# EasyEDA schematic 1-Schematic_Rotopano.json
REV: 2.0; Date: 2018-05-24; Sheet: 1/1; Drawn By: ydethe
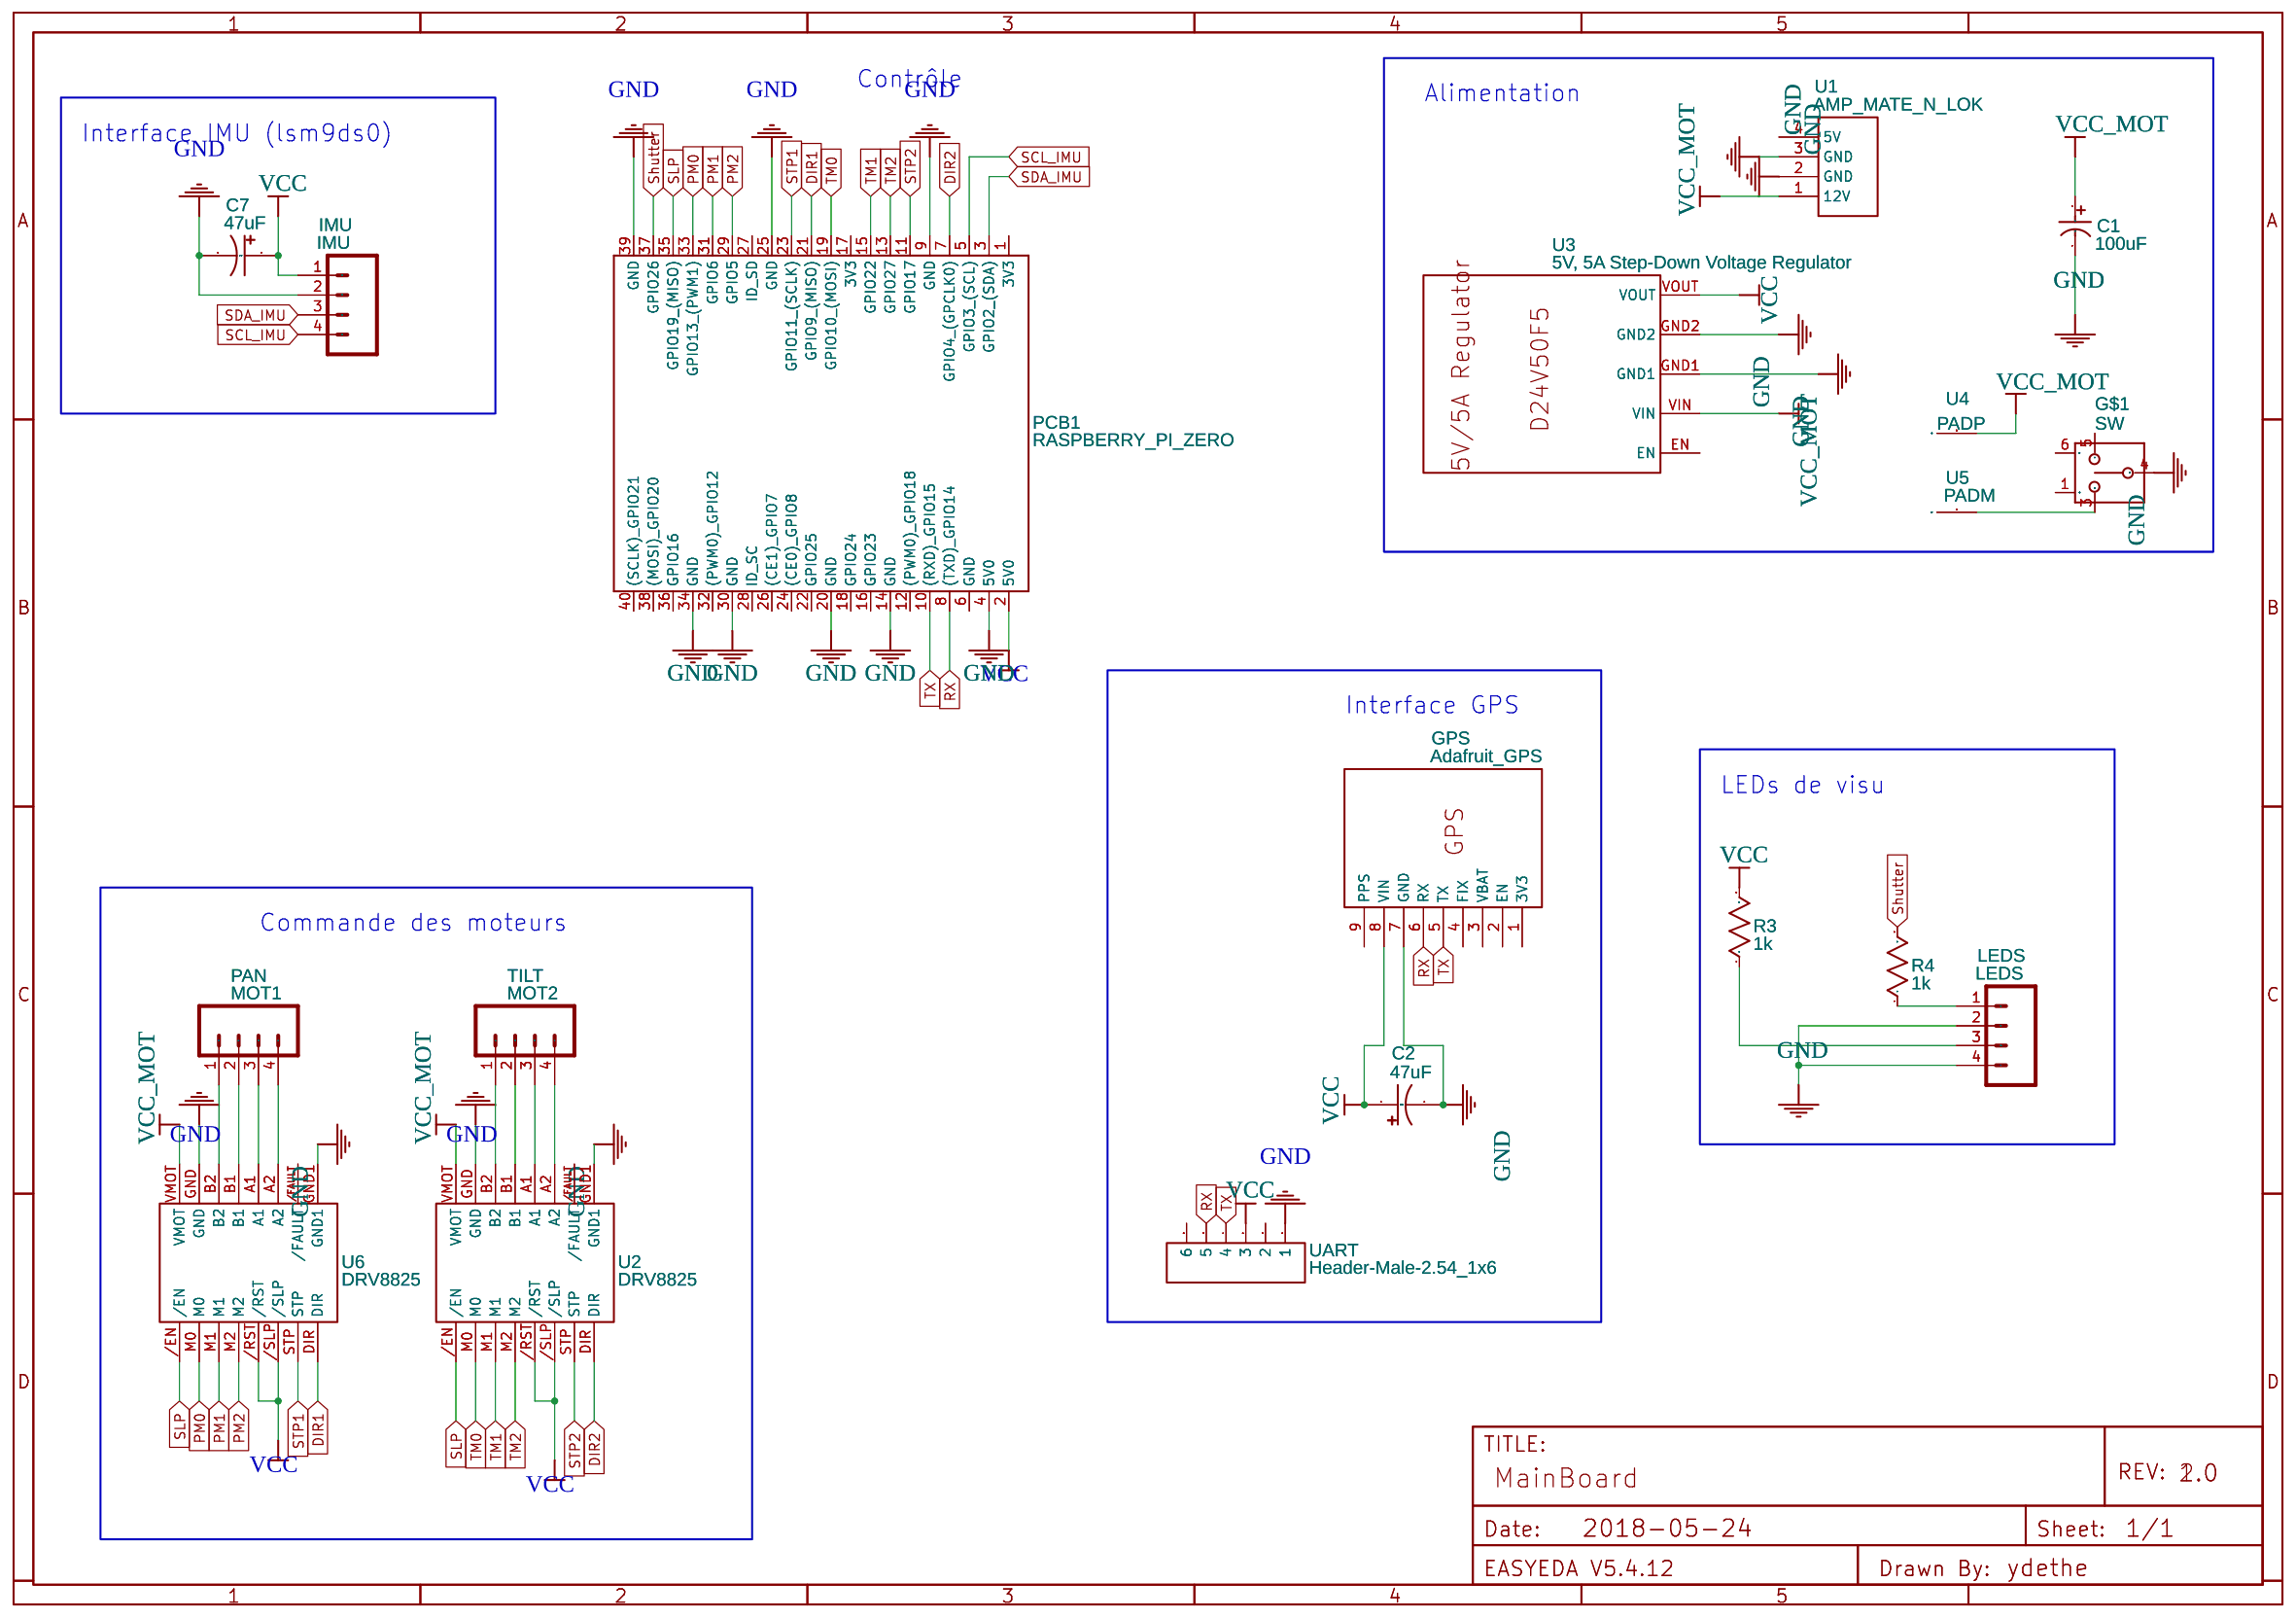
[diagram p0: schematic sheet]

## Parts
C1  100uF  [CAP-8*5]
C2  47uF  [CAP-D6.3XF2.5]
C7  47uF  [CAP-D6.3XF2.5]
G$1  SW  [RSPRO-_734-7315]
GPS  Adafruit_GPS  [ADAFRUIT_GPS]
IMU  IMU  [MOLEX-1X4]
LEDS  LEDS  [MOLEX-1X4]
PAN  MOT1  [MOLEX-1X4]
PCB1  RASPBERRY_PI_ZERO  [RASPBERRY PI (FACE UP)]
R3  1k  [AXIAL-0.3]
R4  1k  [AXIAL-0.3]
TILT  MOT2  [MOLEX-1X4]
U1  AMP_MATE_N_LOK  [AMP_MATE_N_LOK]
U2  DRV8825  [DRV8825]
U3  5V, 5A Step-Down Voltage Regulator  [D24V50F5]
U4  PADP  [PAD-100X55-RRECT]
U5  PADM  [PAD-100X55-RRECT]
U6  DRV8825  [DRV8825]
UART  Header-Male-2.54_1x6  [HDR-6X1/2.54]

## Library data of the parts
C1 = 100uF 25V: Supplier: LCSC; Manufacturer: ReliaPro; Supplier Part: C13376
C2 C7 = Cap_Electrolytic(TH)_D6.3XF2.5_US: Manufacturer Part: ?
G$1 = -: Contributor: liose; Manufacturer Part: ?
GPS = -: Manufacturer Part: Adafruit Ultimate GPS Breakout - 66 channel w/10 Hz updates - Version 3; Supplier Part: undefined; Supplier: Adafruit; link: https://learn.adafruit.com/adafruit-ultimate-gps/overview; Contributor: ydethe
IMU LEDS PAN TILT = -: Header 4; Contributor: SparkFun; Manufacturer Part: ?
PCB1 = -: Raspberry Pi Zero; sourceId: a8qICUO6o; Manufacturer Part: ?
R3 R4 = Res_AXIAL-0.3(1/8W)_US: Manufacturer Part: ?
U1 = -: Manufacturer Part: 350424-1; Supplier Part: 718-9605; Supplier: RS-Online; link: https://fr.rs-online.com/web/p/embases-de-circuit-imprime/7189605/; Contributor: ydethe
U2 U6 = -: Manufacturer Part: Pololu; Contributor: ydethe; Supplier: Pololu; link: https://www.pololu.com/product/2133; Supplier Part: undefined
U3 = -: Contributor: ydethe; Supplier: Pololu; link: https://www.pololu.com/product/2851/pictures
U4 U5 = -: Contributor: Pinoccio; Manufacturer Part: ?
UART = -: Supplier Part: C37208; Supplier: LCSC; Manufacturer: BOOMELE

## Nets
GND: C1.2 C2.2 C7.2 G$1.4(2) GPS.7(GND) IMU.2 LEDS.2 LEDS.4 PCB1.4(5V0) PCB1.9(GND) PCB1.14(GND) PCB1.20(GND) PCB1.25(GND) PCB1.30(GND) PCB1.34(GND) PCB1.39(GND) U1.2(GND) U1.3(GND) U2.GND U2.GND1 U3.GND1 U3.GND2 U6.GND U6.GND1 UART.1
VCC: C2.1 C7.1 GPS.8(VIN) IMU.1 PCB1.2(5V0) R3.2 U2./RST U2./SLP U3.VOUT U6./RST U6./SLP UART.3
VCC_MOT: C1.1 U1.1(12V) U2.VMOT U3.VIN U4.P$1 U6.VMOT
DIR1: PCB1.21(GPIO9 (MISO)) U6.DIR
DIR2: PCB1.7(GPIO4 (GPCLK0)) U2.DIR
PM0: PCB1.33(GPIO13 (PWM1)) U6.M0
PM1: PCB1.31(GPIO6) U6.M1
PM2: PCB1.29(GPIO5) U6.M2
RX: GPS.6(RX) PCB1.8((TXD) GPIO14) UART.5
SCL_IMU: IMU.4 PCB1.5(GPIO3 (SCL))
SDA_IMU: IMU.3 PCB1.3(GPIO2 (SDA))
Shutter: PCB1.37(GPIO26) R4.2
SLP: PCB1.35(GPIO19 (MISO)) U2./EN U6./EN
STP1: PCB1.23(GPIO11 (SCLK)) U6.STP
STP2: PCB1.11(GPIO17) U2.STP
TM0: PCB1.19(GPIO10 (MOSI)) U2.M0
TM1: PCB1.15(GPIO22) U2.M1
TM2: PCB1.13(GPIO27) U2.M2
TX: GPS.5(TX) PCB1.10((RXD) GPIO15) UART.4
PAN_1: PAN.1 U6.B2
PAN_2: PAN.2 U6.B1
PAN_3: PAN.3 U6.A1
PAN_4: PAN.4 U6.A2
R3_1: LEDS.3 R3.1
R4_1: LEDS.1 R4.1
TILT_1: TILT.1 U2.B2
TILT_2: TILT.2 U2.B1
TILT_3: TILT.3 U2.A1
TILT_4: TILT.4 U2.A2
U5_P$1: G$1.3 U5.P$1

Not connected (* = marked no-connect by the designer): G$1 1(G2) 5(1) 6(G1); GPS 1(3V3) 2(EN) 3(VBAT) 4(FIX) 9(PPS); PCB1 1(3V3) 6(GND) 12((PWM0) GPIO18) 16(GPIO23) 17(3V3) 18(GPIO24) 22(GPIO25) 24((CE0) GPIO8) 26((CE1) GPIO7) 27(ID_SD) 28(ID_SC) 32((PWM0) GPIO12) 36(GPIO16) 38((MOSI) GPIO20) 40((SCLK) GPIO21); U1 4(5V); U2 /FAULT; U3 EN; U6 /FAULT; UART 2 6

## Notes on the sheet
- Contrôle
- Alimentation
- Interface IMU (lsm9ds0)
- Interface GPS
- LEDs de visu
- Commande des moteurs
